# Altium schematic sheet RS485 3p connector.schdoc
size 124 x 101 mm
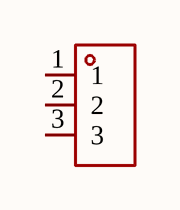
[diagram p0: RS485 3p connector.schdoc]

## Parts
U?  733-363  [CONN-TH_733-363]  (value not drawn)

## Nets

Not connected (* = marked no-connect by the designer): U? 1 2 3

## Library data of the parts
U? = 733-363: Manufacturer: WAGO(万可); Add into BOM: yes; Pitch: 2.5mm; Number of PINs Per Row: 3; Current Rating (Max): 6A; Symbol: 733-363; Device: 733-363; LCSC Part Name: 2.5mm 排数:1 每排P数:3; Supplier Part: C3579942; Manufacturer Part: 733-363; Supplier Footprint: 插件,P=2.5mm; JLCPCB Part Class: Extended Part; Datasheet: https://atta.szlcsc.com/upload/public/pdf/source/20240407/CB0328B38B61B769306C444AB4F51080.pdf; Supplier: LCSC; Convert to PCB: yes; Structure: -; Color: Gray; Mounting Style: Straight Needle; Number of Pins: 3P; Number of Rows: 1; Operating Temperature Range: -60℃~+100℃